# Altium schematic sheet HDMI.SchDoc
size A4
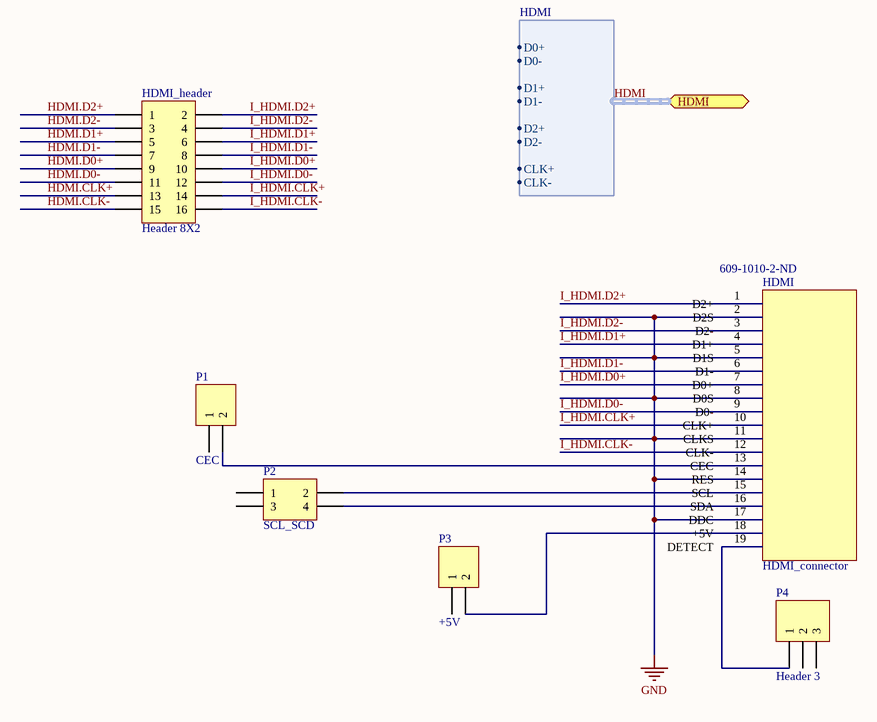
[diagram p0: HDMI.SchDoc]

## Parts
HDMI  HDMI_connector  Supplier Part Number 1: 609-1010-2-ND  [HDMI-type-A]
HDMI_header  Header 8X2  [HDR2X8]
P1  CEC  [HDR1X2]
P2  SCL_SCD  [HDR2X2]
P3  +5V  [HDR1X2]
P4  Header 3  [HDR1X3]

## Ports
HDMI (harness HDMI)

## Harnesses
HDMI: D0+, D0-, D1+, D1-, D2+, D2-, CLK+, CLK-

## Nets
GND: HDMI.2(D2S) HDMI.5(D1S) HDMI.8(D0S) HDMI.11(CLKS) HDMI.14(RES) HDMI.17(DDC)
HDMI.CLK+: HDMI_header.13
HDMI.CLK-: HDMI_header.15
HDMI.D0+: HDMI_header.9
HDMI.D0-: HDMI_header.11
HDMI.D1+: HDMI_header.5
HDMI.D1-: HDMI_header.7
HDMI.D2+: HDMI_header.1
HDMI.D2-: HDMI_header.3
I_HDMI.CLK+: HDMI.10(CLK+) HDMI_header.14
I_HDMI.CLK-: HDMI.12(CLK-) HDMI_header.16
I_HDMI.D0+: HDMI.7(D0+) HDMI_header.10
I_HDMI.D0-: HDMI.9(D0-) HDMI_header.12
I_HDMI.D1+: HDMI.4(D1+) HDMI_header.6
I_HDMI.D1-: HDMI.6(D1-) HDMI_header.8
I_HDMI.D2+: HDMI.1(D2+) HDMI_header.2
I_HDMI.D2-: HDMI.3(D2-) HDMI_header.4
NetHDMI_13: HDMI.13(CEC) P1.2
NetHDMI_15: HDMI.15(SCL) P2.2
NetHDMI_16: HDMI.16(SDA) P2.4
NetHDMI_18: HDMI.18(+5V) P3.2
NetHDMI_19: HDMI.19(DETECT) P4.1

Not connected (* = marked no-connect by the designer): P1 1; P2 1 3; P3 1; P4 2 3

## Buses and harness runs
harness HDMI = port HDMI

## Library data of the parts
HDMI = HDMI_connector: Manufacturer: FCI; Manufacturer Part Number: 10029449-001RLF; Connector Type: HDMI; Number of Contacts: 19; Gender: Receptacle; Supplier 1: Digi-Key; RoHS: RoHS Compliant; Category: Connectors, Interconnects; Stock 1: 12400; Pricing 1: 400=0.69795, 800=0.61071, 1200=0.55837, 2000=0.52347, 2800=0.50601, 10000=0.46414, 20000=0.45367 (EUR); Packaging: Tape & Reel (TR); Specifications: -; Mounting Type: Surface Mount, Right Angle, Horizontal; Features: -; Ingress Protection: -; ComponentLink1URL: http://portal.fciconnect.com/Comergent//fci/drawing/10029449.pdf; ComponentLink1Description: http://portal.fciconnect.com/Comergent//fci/drawing/10029449.pdf
HDMI_header = Header 8X2: Header, 8-Pin, Dual row; LatestRevisionDate: 17-Jul-2002; LatestRevisionNote: Re-released for DXP Platform.; Publisher: Altium Limited
P1 P3 = Header 2: Header, 2-Pin; LatestRevisionDate: 17-Jul-2002; LatestRevisionNote: Re-released for DXP Platform.; Publisher: Altium Limited
P2 = Header 2X2: Header, 2-Pin, Dual row; LatestRevisionDate: 17-Jul-2002; LatestRevisionNote: Re-released for DXP Platform.; Publisher: Altium Limited
P4 = Header 3: Header, 3-Pin; LatestRevisionDate: 17-Jul-2002; LatestRevisionNote: Re-released for DXP Platform.; Publisher: Altium Limited